# EAGLE design Crazebird-v0.5 (EAGLE 6.6.0)
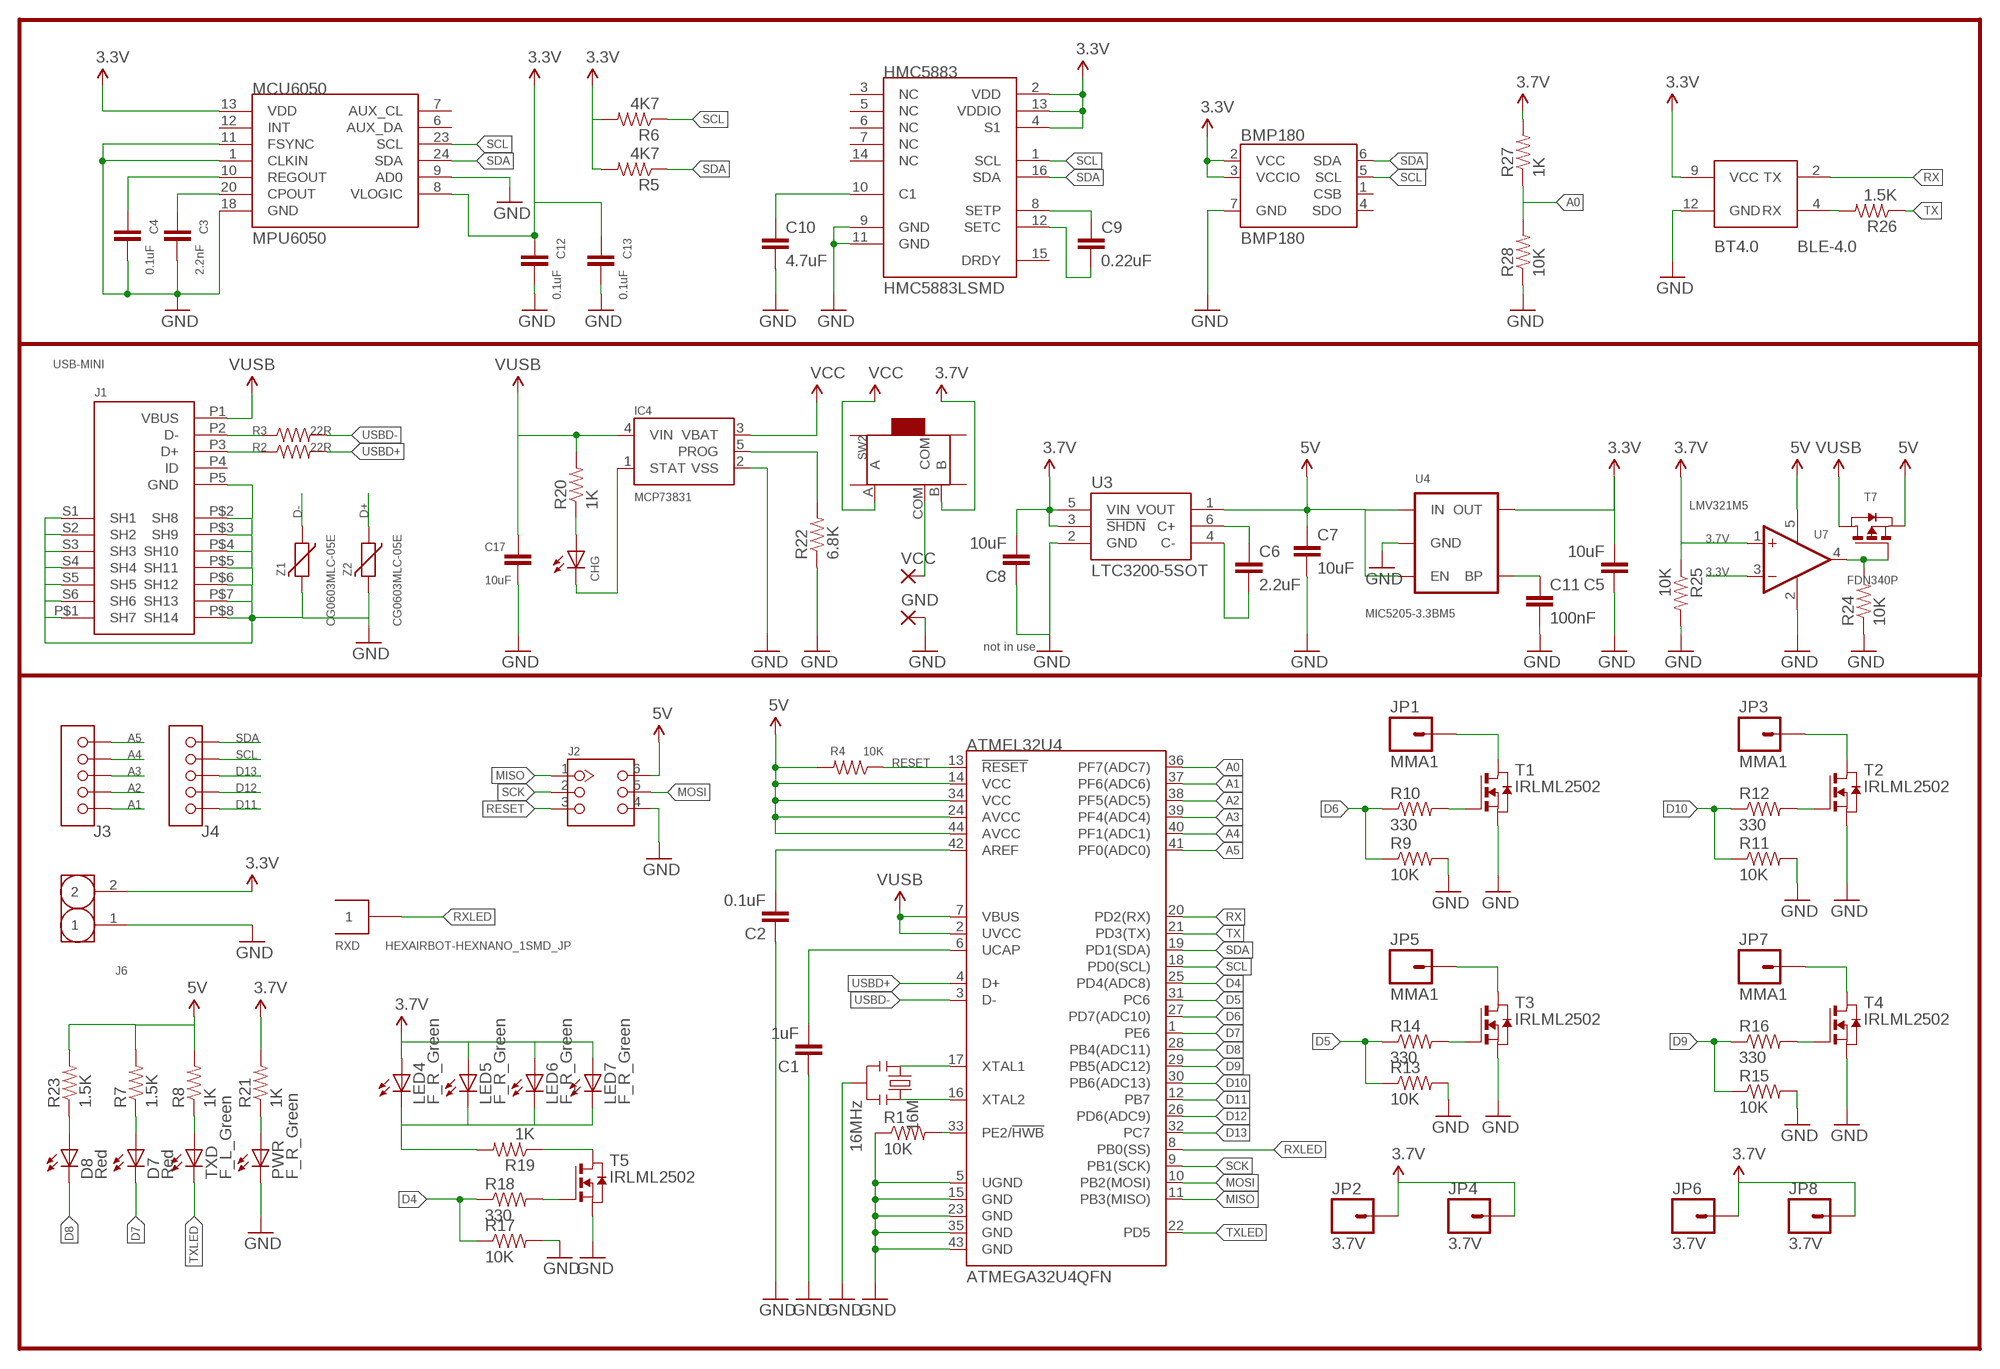
[diagram p0: schematic, sheet 1]

## Parts
16M  16MHz  RESONATOR16MHZ  [RESONATOR-SMD]
ATMEL32U4  ATMEGA32U4QFN  [SPARKFUN-DIGITALIC_QFN-44]
BMP180  BMP180  [BMP180]
BT4.0  BLE-4.0  HEXAIRBOT-HEXNANO_BLUETOOTH_HM11  [HEXAIRBOT-HEXNANO_BLUETOOTH_HM11]
C1  1uF  CAP0402-CAP  [0402-CAP]
C2  0.1uF  CAP0402-CAP  [0402-CAP]
C3  2.2nF  CAP0402-CAP  [0402-CAP]
C4  0.1uF  CAP0402-CAP  [0402-CAP]
C5  10uF  CAP0402-CAP  [0402-CAP]
C6  2.2uF  CAP0603-CAP  [0603-CAP]
C7  10uF  CAP0603-CAP  [0603-CAP]
C8  10uF  CAP0805  [0805]
C9  0.22uF  CAP0402-CAP  [0402-CAP]
C10  4.7uF  CAP0402-CAP  [0402-CAP]
C11  100nF  CAP0603-CAP  [0603-CAP]
C12  0.1uF  CAP0402-CAP  [0402-CAP]
C13  0.1uF  CAP0402-CAP  [0402-CAP]
C17  10uF  CAP0805  [0805]
CHG  Yellow  LEDCHIPLED_0603  [CHIPLED_0603]
D7  Red  LEDCHIPLED_0603  [CHIPLED_0603]
D8  Red  LEDCHIPLED_0603  [CHIPLED_0603]
GND  2,15/1,0  [2,15/1,0]
HMC5883  HMC5883LSMD  [16LPCC]
IC4  MCP73831  [SOT23-5]
J1  USB-MINI  [USB_MICRO]
J2  HEADER-2X3P-2.0  [2X3P-2.0]
J3  HEADER-5P-2.0  [5P-2.0]
J4  HEADER-5P-2.0  [5P-2.0]
J6  HEADER-2P-2.0  [2P-2.0]
JP1  MMA1  M01SMD-4.5X1.5  [PAD-1.5X4.5]
JP2  3.7V  M01SMD-4.5X1.5  [PAD-1.5X4.5]
JP3  MMA1  M01SMD-4.5X1.5  [PAD-1.5X4.5]
JP4  3.7V  M01SMD-4.5X1.5  [PAD-1.5X4.5]
JP5  MMA1  M01SMD-4.5X1.5  [PAD-1.5X4.5]
JP6  3.7V  M01SMD-4.5X1.5  [PAD-1.5X4.5]
JP7  MMA1  M01SMD-4.5X1.5  [PAD-1.5X4.5]
JP8  3.7V  M01SMD-4.5X1.5  [PAD-1.5X4.5]
LED4  F_R_Green  LEDCHIPLED_0603  [CHIPLED_0603]
LED5  F_R_Green  LEDCHIPLED_0603  [CHIPLED_0603]
LED6  F_R_Green  LEDCHIPLED_0603  [CHIPLED_0603]
LED7  F_R_Green  LEDCHIPLED_0603  [CHIPLED_0603]
MCU6050  MPU6050  TESTING_MPU-6050-1  [TESTING_QFN-24-4MM2]
PWR  F_R_Green  LEDCHIPLED_0603  [CHIPLED_0603]
R1  10K  RESISTOR0402-RES  [0402-RES]
R2  22R  RESISTOR0402-RES  [0402-RES]
R3  22R  RESISTOR0402-RES  [0402-RES]
R4  10K  RESISTOR0402-RES  [0402-RES]
R5  4K7  RESISTOR0402-RES  [0402-RES]
R6  4K7  RESISTOR0402-RES  [0402-RES]
R7  1.5K  RESISTOR0402-RES  [0402-RES]
R8  1K  RESISTOR0402-RES  [0402-RES]
R9  10K  RESISTOR0402-RES  [0402-RES]
R10  330  RESISTOR0402-RES  [0402-RES]
R11  10K  RESISTOR0402-RES  [0402-RES]
R12  330  RESISTOR0402-RES  [0402-RES]
R13  10K  RESISTOR0402-RES  [0402-RES]
R14  330  RESISTOR0402-RES  [0402-RES]
R15  10K  RESISTOR0402-RES  [0402-RES]
R16  330  RESISTOR0402-RES  [0402-RES]
R17  10K  RESISTOR0402-RES  [0402-RES]
R18  330  RESISTOR0402-RES  [0402-RES]
R19  1K  RESISTOR0402-RES  [0402-RES]
R20  1K  RESISTOR0402-RES  [0402-RES]
R21  1K  RESISTOR0402-RES  [0402-RES]
R22  6.8K  RESISTOR0402-RES  [0402-RES]
R23  1.5K  RESISTOR0402-RES  [0402-RES]
R24  10K  RESISTOR0402-RES  [0402-RES]
R25  10K  RESISTOR0402-RES  [0402-RES]
R26  1.5K  RESISTOR0402-RES  [0402-RES]
R27  1K  RESISTOR0402-RES  [0402-RES]
R28  10K  RESISTOR0402-RES  [0402-RES]
RXD  HEXAIRBOT-HEXNANO_1SMD_JP  [HEXAIRBOT-HEXNANO_1SMD]
SW2  SWITCH-3P-SMD-6.6X2.8  [3P-SMD-2CH-6.6X2.8-REINFORCE]
T1  IRLML2502  NMOSSOT23  [SOT-23]
T2  IRLML2502  NMOSSOT23  [SOT-23]
T3  IRLML2502  NMOSSOT23  [SOT-23]
T4  IRLML2502  NMOSSOT23  [SOT-23]
T5  IRLML2502  NMOSSOT23  [SOT-23]
T7  FDN340P  [SOT23]
TXD  F_L_Green  LEDCHIPLED_0603  [CHIPLED_0603]
U3  LTC3200-5SOT  [SOT23-6]
U4  MIC5205-3.3BM5  MIC52053.3V  [SOT23-5]
U7  LMV321M5  [SOT23-5]
VCC  2,15/1,0  [2,15/1,0]
Z1  CG0603MLC-05E  VARISTORCN0603  [CT/CN0603]
Z2  CG0603MLC-05E  VARISTORCN0603  [CT/CN0603]

## Nets
3.3V: BMP180.2(VCC) BMP180.3(VCCIO) BT4.0.9(VCC) C5.2 C12.1 C13.1 HMC5883.2(VDD) HMC5883.4(S1) HMC5883.13(VDDIO) J6.2 MCU6050.8(VLOGIC) MCU6050.13(VDD) R5.2 R6.2 U4.5(OUT) U7.3(-IN)
3.7V: C8.2 JP2.P$1 JP4.P$1 JP6.P$1 JP8.P$1 LED4.A LED5.A LED6.A LED7.A R21.2 R25.1 R27.2 SW2.B U3.3(!SHDN) U3.5(VIN) U7.1(+IN)
5V: ATMEL32U4.14(VCC) ATMEL32U4.24(AVCC) ATMEL32U4.34(VCC) ATMEL32U4.44(AVCC) C7.1 J2.6 R4.2 R7.2 R8.2 R23.2 T7.2(S) U3.1(VOUT) U4.1(IN) U4.3(EN) U7.5(V+)
A0: ATMEL32U4.36(PF7(ADC7)) R27.1 R28.2
A1: ATMEL32U4.37(PF6(ADC6)) J3.1
A2: ATMEL32U4.38(PF5(ADC5)) J3.2
A3: ATMEL32U4.39(PF4(ADC4)) J3.3
A4: ATMEL32U4.40(PF1(ADC1)) J3.4
A5: ATMEL32U4.41(PF0(ADC0)) J3.5
D4: ATMEL32U4.25(PD4(ADC8)) R17.1 R18.1
D5: ATMEL32U4.31(PC6) R13.1 R14.1
D6: ATMEL32U4.27(PD7(ADC10)) R9.1 R10.1
D7: ATMEL32U4.1(PE6) D7.C
D8: ATMEL32U4.28(PB4(ADC11)) D8.C
D9: ATMEL32U4.29(PB5(ADC12)) R15.1 R16.1
D10: ATMEL32U4.30(PB6(ADC13)) R11.1 R12.1
D11: ATMEL32U4.12(PB7) J4.1
D12: ATMEL32U4.26(PD6(ADC9)) J4.2
D13: ATMEL32U4.32(PC7) J4.3
D+: J1.P3(D+) R2.1 Z2.1
D-: J1.P2(D-) R3.1 Z1.1
GND: 16M.2 ATMEL32U4.5(UGND) ATMEL32U4.15(GND) ATMEL32U4.23(GND) ATMEL32U4.35(GND) ATMEL32U4.43(GND) BMP180.7(GND) BT4.0.12(GND) C1.1 C2.1 C3.2 C4.2 C5.1 C7.2 C8.1 C10.2 C11.2 C12.2 C13.2 C17.1 GND.1(P) HMC5883.9(GND) HMC5883.11(GND) IC4.2(VSS) J1.P5(GND) J1.P$1(SH7) J1.P$2(SH8) J1.P$3(SH9) J1.P$4(SH10) J1.P$5(SH11) J1.P$6(SH12) J1.P$7(SH13) J1.P$8(SH14) J1.S1(SH1) J1.S2(SH2) J1.S3(SH3) J1.S4(SH4) J1.S5(SH5) J1.S6(SH6) J2.4 J6.1 MCU6050.1(CLKIN) MCU6050.9(AD0) MCU6050.11(FSYNC) MCU6050.18(GND) PWR.C R1.1 R9.2 R11.2 R13.2 R15.2 R17.2 R22.1 R24.1 R25.2 R28.1 T1.2(S) T2.2(S) T3.2(S) T4.2(S) T5.2(S) U3.2(GND) U4.2(GND) U7.2(V-) Z1.2 Z2.2
MISO: ATMEL32U4.11(PB3(MISO)) J2.1
MOSI: ATMEL32U4.10(PB2(MOSI)) J2.5
N$1: 16M.1 ATMEL32U4.17(XTAL1)
N$2: 16M.3 ATMEL32U4.16(XTAL2)
N$3: CHG.C IC4.1(STAT)
N$4: CHG.A R20.1
N$5: ATMEL32U4.6(UCAP) C1.2
N$6: ATMEL32U4.42(AREF) C2.2
N$7: R8.1 TXD.A
N$8: C4.1 MCU6050.10(REGOUT)
N$9: C3.1 MCU6050.20(CPOUT)
N$10: D7.A R7.1
N$11: ATMEL32U4.33(PE2/!HWB) R1.2
N$12: R18.2 T5.3(G)
N$13: PWR.A R21.1
N$14: R12.2 T2.3(G)
N$15: R10.2 T1.3(G)
N$16: JP1.P$1 T1.1(D)
N$17: JP3.P$1 T2.1(D)
N$18: R14.2 T3.3(G)
N$19: JP5.P$1 T3.1(D)
N$20: R16.2 T4.3(G)
N$21: JP7.P$1 T4.1(D)
N$22: R19.1 T5.1(D)
N$23: C9.1 HMC5883.8(SETP)
N$24: LED4.C LED5.C LED6.C LED7.C R19.2
N$25: C6.1 U3.6(C+)
N$26: IC4.5(PROG) R22.2
N$27: C6.2 U3.4(C-)
N$28: C9.2 HMC5883.12(SETC)
N$29: C10.1 HMC5883.10(C1)
N$30: SW2.COM VCC.1(P)
N$31: C11.1 U4.4(BP)
N$32: D8.A R23.1
N$34: R24.2 T7.3(G) U7.4(OUT)
N$35: BT4.0.4(RX) R26.2
RESET: ATMEL32U4.13(!RESET) J2.3 R4.1
RX: ATMEL32U4.20(PD2(RX)) BT4.0.2(TX)
RXLED: ATMEL32U4.8(PB0(SS)) RXD.1
SCK: ATMEL32U4.9(PB1(SCK)) J2.2
SCL: ATMEL32U4.18(PD0(SCL)) BMP180.5(SCL) HMC5883.1(SCL) J4.4 MCU6050.23(SCL) R6.1
SDA: ATMEL32U4.19(PD1(SDA)) BMP180.6(SDA) HMC5883.16(SDA) J4.5 MCU6050.24(SDA) R5.1
TX: ATMEL32U4.21(PD3(TX)) R26.1
TXLED: ATMEL32U4.22(PD5) TXD.C
USBD+: ATMEL32U4.4(D+) R2.2
USBD-: ATMEL32U4.3(D-) R3.2
VCC: IC4.3(VBAT) SW2.A
VUSB: ATMEL32U4.2(UVCC) ATMEL32U4.7(VBUS) C17.2 IC4.4(VIN) J1.P1(VBUS) R20.2 T7.1(D)
Unconnected: BMP180.1(CSB) BMP180.4(SDO) HMC5883.3(NC) HMC5883.5(NC) HMC5883.6(NC) HMC5883.7(NC) HMC5883.14(NC) HMC5883.15(DRDY) J1.P4(ID) MCU6050.6(AUX_DA) MCU6050.7(AUX_CL) MCU6050.12(INT) SW2.SS1 SW2.SS2 SW2.SS3 SW2.SS4

## Notes on the sheet
- not in use

## Library data of the parts
16M = SparkFun-FreqCtrl:RESONATOR: Resonator Small SMD resonator. Used, eg, on the Arduino Pro/ Pro Mini boards. 8MHz- XTAL-08895 16MHz- XTAL-08900; PROD_ID: XTAL-08900
ATMEL32U4 = SparkFun-DigitalIC:ATMEGA32U4: Atmel 44-pin 8-bit Microcontroller with 32KBytes of ISP Flash and USB Controller ----- Please use the QFN-44-NOPAD_1:1 package for the footprint of all boards using a 32U4. Route traces directly away from the pads as much as possible.
BMP180 = duinofun-ic:BMP180: BMP085 Pressure Sensor Great little MEMS pressure sensor. SKU: COM-09603
BT4.0 = MainBoard:HEXAIRBOT-HEXNANO_BLUETOOTH_HM11: BLE 4.0 Module
C1-C13 = SparkFun-Passives:CAP: Capacitor Standard 0603 ceramic capacitor, and 0.1" leaded capacitor.
C17 = SparkFun:CAP: Capacitor Standard 0603 ceramic capacitor, and 0.1" leaded capacitor.
CHG D7 D8 LED4-LED7 PWR TXD = led:LED: LED OSRAM: - CHIPLED LG R971, LG N971, LY N971, LG Q971, LY Q971, LO R971, LY R971 LH N974, LH R974 LS Q976, LO Q976, LY Q976 LO Q996 - Hyper CHIPLED LW Q18S LB Q993, LB Q99A, LB R99A - SideLED LS A670, LO A670, LY A670, LG A670, LP A670 LB A673, LV A673, LT A673, LW A673 LH A674 LY A675 LS A676, LA A676, LO A676, LY A676, LW A676 LS A679, LY A679, LG A679 - Hyper Micro SIDELED® LS Y876, LA Y876, LO Y876, LY Y876 LT Y87S - SmartLED LW L88C, LW L88S LB L89C, LB L89S, LG L890 LS L89K, LO L89K, LY L89K LS L896, LA L896, LO L896, LY L896 - TOPLED LS T670, LO T670, LY T670, LG T670, LP T670 LSG T670, LSP T670, LSY T670, LOP T670, LYG T670 LG T671, LOG T671, LSG T671 LB T673, LV T673, LT T673, LW T673 LH T674 LS T676, LA T676, LO T676, LY T676, LB T676, LH T676, LSB T676, LW T676 LB T67C, LV T67C, LT T67C, LS T67K, LO T67K, LY T67K, LW E67C LS E67B, LA E67B, LO E67B, LY E67B, LB E67C, LV E67C, LT E67C LW T67C LS T679, LY T679, LG T679 LS T770, LO T770, LY T770, LG T770, LP T770 LB T773, LV T773, LT T773, LW T773 LH T774 LS E675, LA E675, LY E675, LS T675 LS T776, LA T776, LO T776, LY T776, LB T776 LHGB T686 LT T68C, LB T68C - Hyper Mini TOPLED® LB M676 - Mini TOPLED Santana® LG M470 LS M47K, LO M47K, LY M47K Source: http://www.osram.convergy.de LUXEON: - LUMILED® LXK2-PW12-R00, LXK2-PW12-S00, LXK2-PW14-U00, LXK2-PW14-V00 LXK2-PM12-R00, LXK2-PM12-S00, LXK2-PM14-U00 LXK2-PE12-Q00, LXK2-PE12-R00, LXK2-PE12-S00, LXK2-PE14-T00, LXK2-PE14-U00 LXK2-PB12-K00, LXK2-PB12-L00, LXK2-PB12-M00, LXK2-PB14-N00, LXK2-PB14-P00, LXK2-PB14-Q00 LXK2-PR12-L00, LXK2-PR12-M00, LXK2-PR14-Q00, LXK2-PR14-R00 LXK2-PD12-Q00, LXK2-PD12-R00, LXK2-PD12-S00 LXK2-PH12-R00, LXK2-PH12-S00 LXK2-PL12-P00, LXK2-PL12-Q00, LXK2-PL12-R00 Source: www.luxeon.com KINGBRIGHT: KA-3528ASYC Source: www.kingbright.com
GND VCC = wirepad:2,15/1,0: THROUGH-HOLE PAD
HMC5883 = HexAirbot-HexNano:HMC5883L: 3 Axis Digital Compass IC
IC4 = SparkFun:MCP73831: Microchip's MCP73831 Miniature single cell, fully integrated Li-Ion, Li-polymer charge management controller http://ww1.microchip.com/downloads/en/DeviceDoc/21984a.pdf
J1 = QXZ:USB-MINI
J2 = SeeedStudio-Connector:HEADER-2X3P
J3 J4 = SeeedStudio-Connector:HEADER-5P
J6 = SeeedStudio-Connector:HEADER-2P
JP1-JP8 = SparkFun-Connectors:M01: Header 1 Standard 1-pin 0.1" header. Use with straight break away headers (SKU : PRT-00116), right angle break away headers (PRT-00553), swiss pins (PRT-00743), machine pins (PRT-00117), and female headers (PRT-00115).
MCU6050 = MPU6050:TESTING_MPU-6050
R1-R28 = SparkFun-Passives:RESISTOR: Resistor Basic schematic elements and footprints for 0603, 1206, and PTH resistors.
RXD = MainBoard:HEXAIRBOT-HEXNANO_1SMD_JP
SW2 = duinofun-ic:SWITCH-3P-SMD
T1-T5 = zetex:NMOSSOT23: MOS FET; OC_FARNELL: unknown; OC_NEWARK: unknown
T7 = HexAirbot-HexNano:FDN340P: MOS FET
U3 = HexAirbot-HexNano:LTC3200-5: Linear Technology. Low Noise, Regulated Charge Pump DC/DC Converters, SOT23-6. Fixed 5V ± 4% Output or ADJ VIN Range: 2.7V to 4.5V
U4 = SparkFun-PowerIC:MIC5205: MIC5205 150mA vreg 3.3V - VREG-00822 5V - VREG-00823; PROD_ID: VREG-00822
U7 = linear:LMV321?*: General Purpose, Low Voltage, Rail-to-Rail Output Operational Amplifiers Source: http://www.national.com/mpf/LM/LMV321.html http://www.national.com/dt/lmv_qual.pdf
Z1 Z2 = varistor:VARISTOR: VARISTOR

## Net classes
0 default: width 0.254 mm, drill 0.61 mm, clearance 0.254 mm
2 gnd: width 0.254 mm, drill 0.61 mm, clearance 0.254 mm

## Board
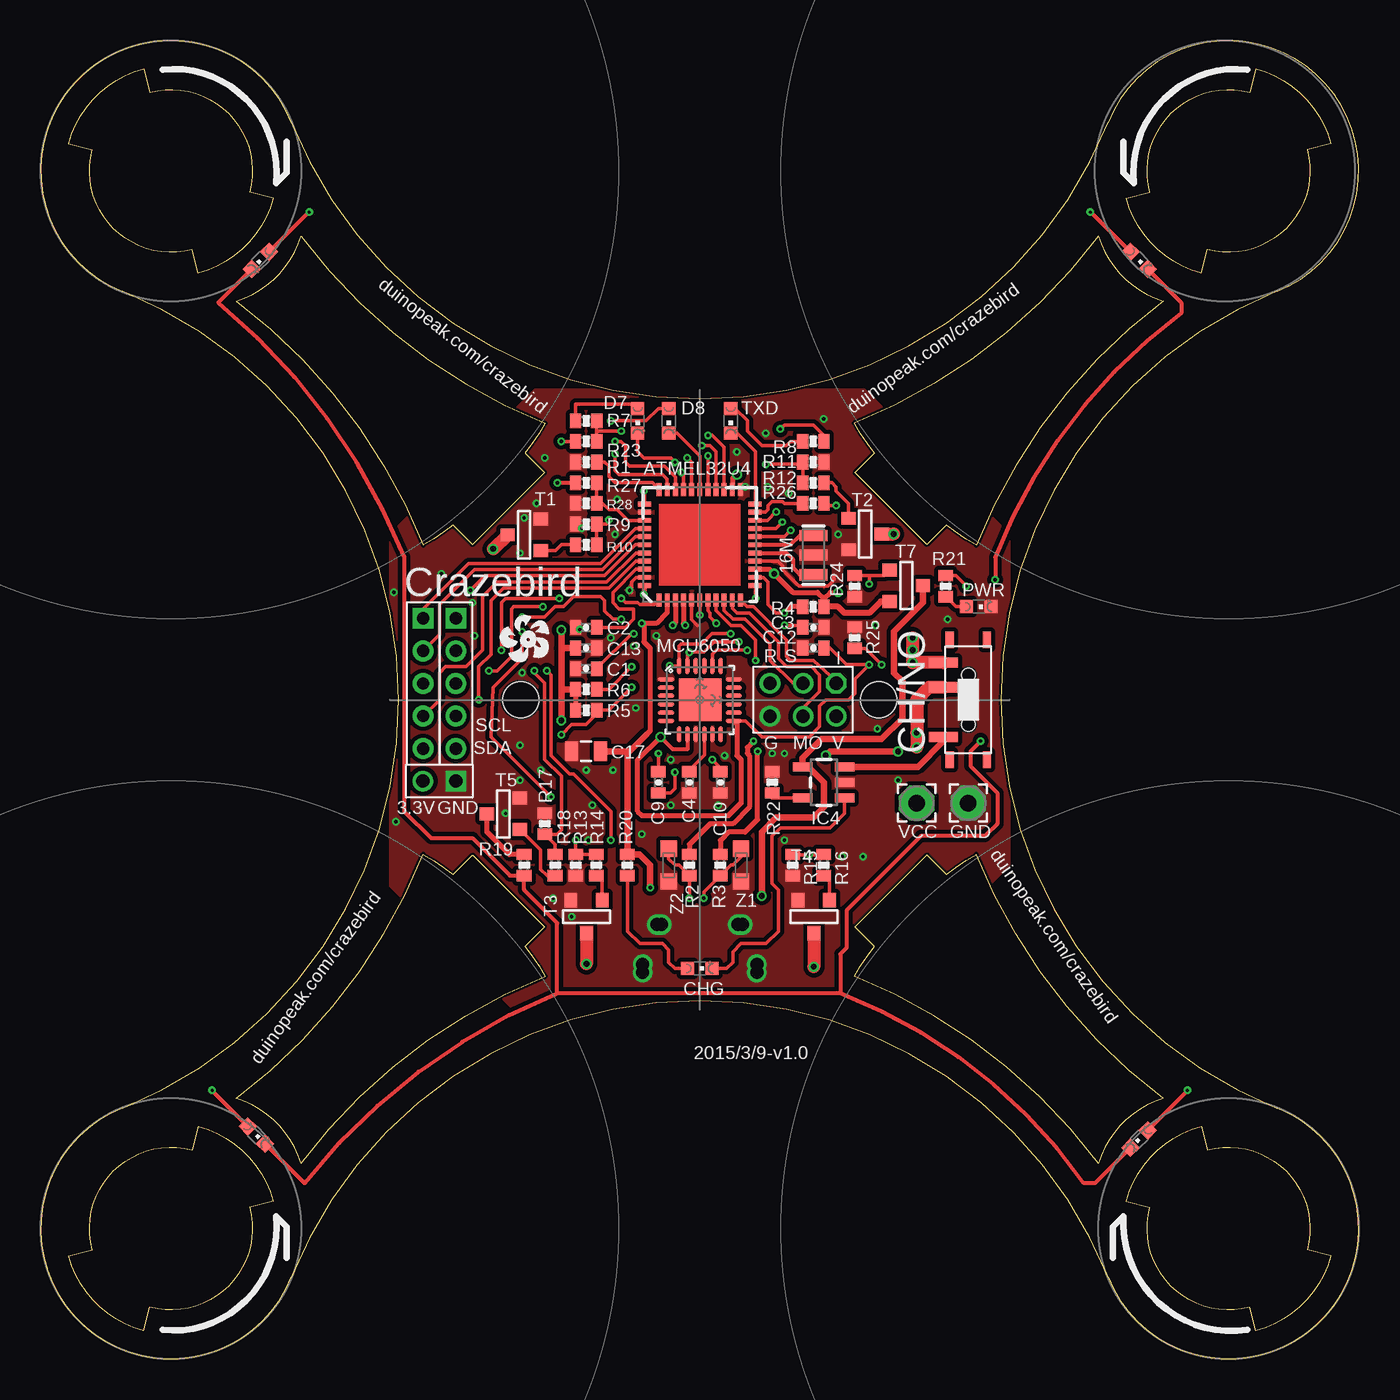
[diagram p1: board, top side]
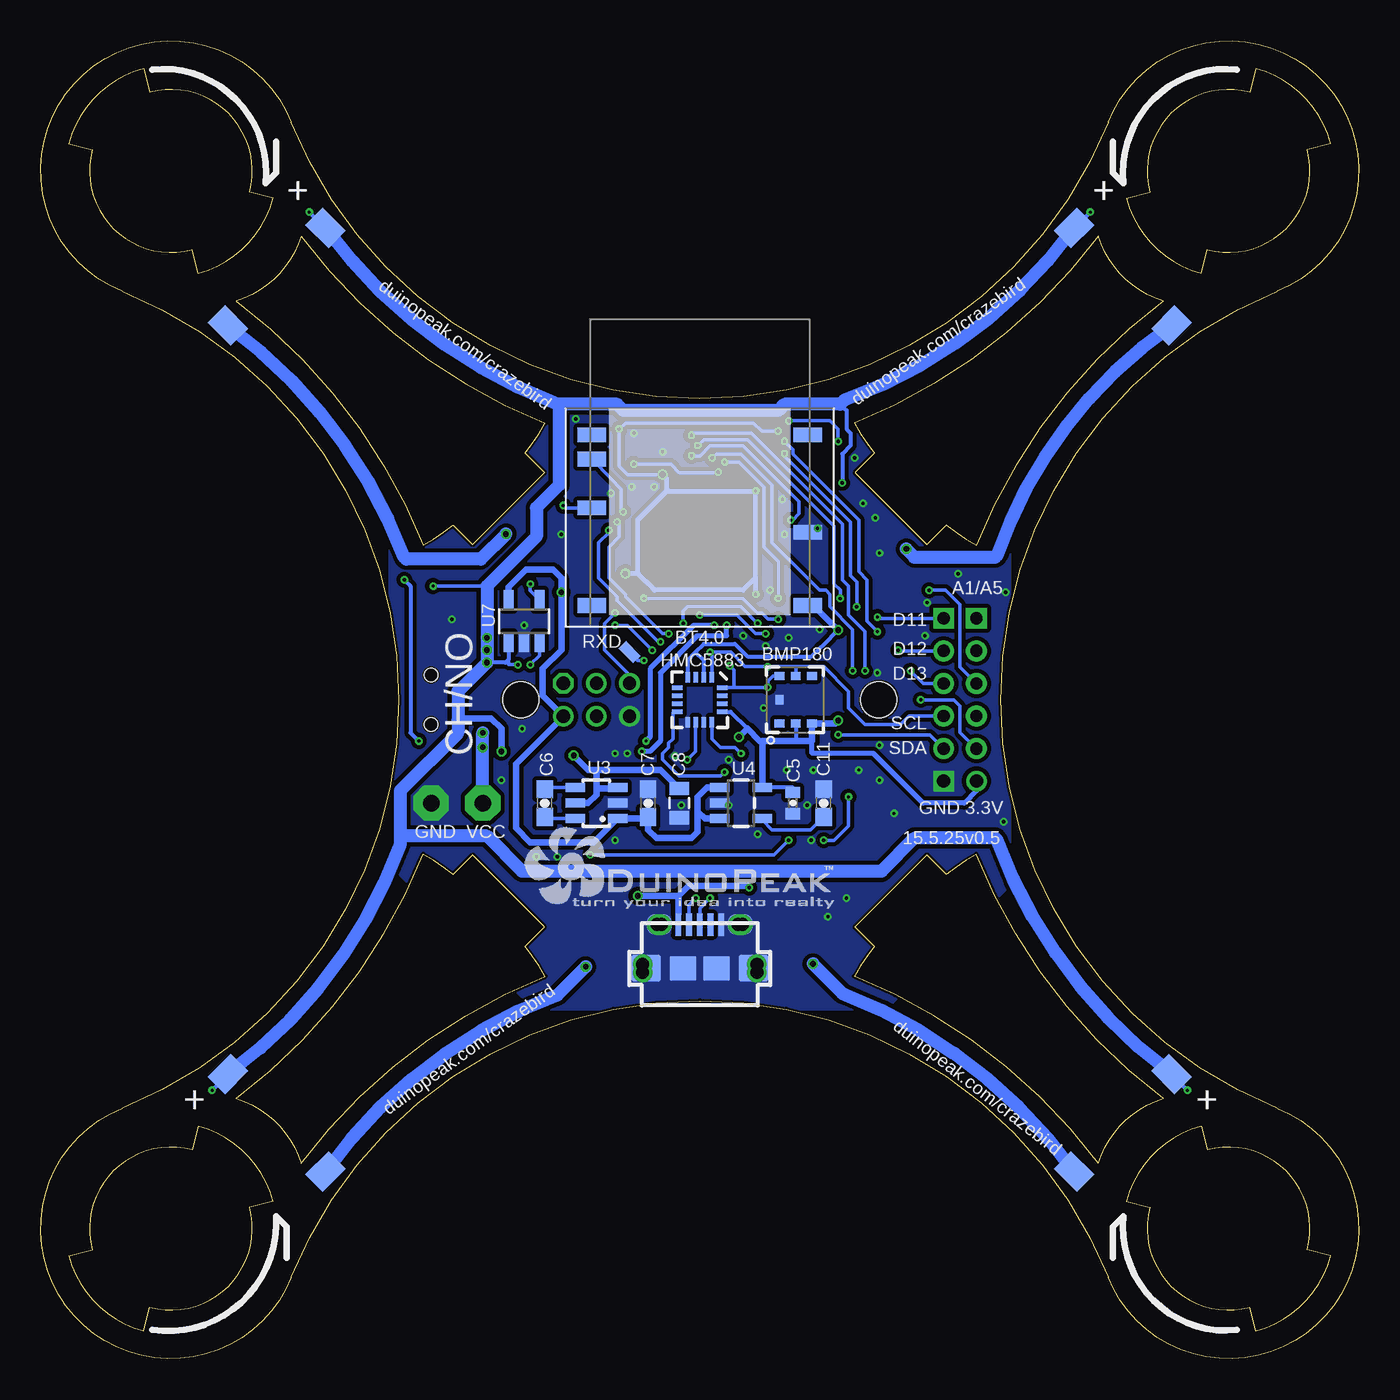
[diagram p2: board, bottom side, seen from below]

Size 81.01 x 81.01 mm. Coordinates in mm from the lower left corner, seen from the top.
Copper layers (1*16): Top 0.035mm / dielectric 1.5mm / Bottom 0.035mm
Design rules "Sparkfun *": minimum track width 5mil, minimum drill 8mil, track to track 5mil, track to pad 5mil, pad to pad 8mil, via to via 8mil, smd to smd 5mil, copper to edge 5mil, drill to drill 8mil, minimum pad ring 7mil, minimum via ring 5mil, stop-mask expansion 4mil, vias tented up to drill 25mil, thermal gap 5mil

### Footprints (pad centres in the part's own frame; a part is rotated, then mirrored left to right if it is on the bottom)
RESONATOR-SMD = smd 0.7 x 1.7: 1 -1.2,0; 2 0,0; 3 1.2,0
SPARKFUN-DIGITALIC_QFN-44 = smd 0.8 x 0.3: 1 -3.4,2.5; 2 -3.4,2; 3 -3.4,1.5; 4 -3.4,1; 5 -3.4,0.5; 6 -3.4,0; 7 -3.4,-0.5; 8 -3.4,-1; 9 -3.4,-1.5; 10 -3.4,-2; 11 -3.4,-2.5; 23 3.4,-2.5; 24 3.4,-2; 25 3.4,-1.5; 26 3.4,-1; 27 3.4,-0.5; 28 3.4,0; 29 3.4,0.5; 30 3.4,1; 31 3.4,1.5; 32 3.4,2; 33 3.4,2.5 | smd 0.3 x 0.8: 12 -2.5,-3.4; 13 -2,-3.4; 14 -1.5,-3.4; 15 -1,-3.4; 16 -0.5,-3.4; 17 0,-3.4; 18 0.5,-3.4; 19 1,-3.4; 20 1.5,-3.4; 21 2,-3.4; 22 2.5,-3.4; 34 2.5,3.4; 35 2,3.4; 36 1.5,3.4; 37 1,3.4; 38 0.5,3.4; 39 0,3.4; 40 -0.5,3.4; 41 -1,3.4; 42 -1.5,3.4; 43 -2,3.4; 44 -2.5,3.4
BMP180 = smd 0.5 x 0.6: 1 -1.45,1.45; 2 -1.45,0.45; 3 -1.45,-0.55; 4 1.45,-0.55; 5 1.45,0.45; 6 1.45,1.45 | smd 0.6 x 0.5: 7 0,1.45
HEXAIRBOT-HEXNANO_BLUETOOTH_HM11 = smd 1.75 x 0.9: 1 -6.625,4.859; 2 -6.625,3.359; 4 -6.625,0.359; 8 -6.625,-5.641; 9 6.625,-5.641; 12 6.625,-1.141; 16 6.625,4.859
0402-CAP = smd 0.7 x 0.9: 1 -0.65,0; 2 0.65,0
0603-CAP = smd 1.1 x 1: 1 -0.85,0; 2 0.85,0
0805 = smd 0.8 x 1.2: 1 -0.9,0; 2 0.9,0
CHIPLED_0603 = smd 0.8 x 0.8: A 0,-0.75; C 0,0.75
2,15/1,0 = drill 1.016 pad 2.159 octagon: 1 0,0
16LPCC = smd 0.65 x 0.28: 1 -1.37,0.75; 2 -1.37,0.25; 3 -1.37,-0.25; 4 -1.37,-0.75; 9 1.37,-0.75; 10 1.37,-0.25; 11 1.37,0.25; 12 1.37,0.75 | smd 0.28 x 0.65: 5 -0.75,-1.37; 6 -0.25,-1.37; 7 0.25,-1.37; 8 0.75,-1.37; 13 0.75,1.37; 14 0.25,1.37; 15 -0.25,1.37; 16 -0.75,1.37
SOT23-5 = smd 0.55 x 1.2: 1 -0.95,-1.3; 2 0,-1.3; 3 0.95,-1.3; 4 0.95,1.3; 5 -0.95,1.3
USB_MICRO = smd 0.406 x 1.346: P1 -1.321,2.692; P2 -0.66,2.692; P3 0,2.692; P4 0.66,2.692; P5 1.321,2.692 | drill 0.8 pad 1.27: P$1 -2.616,2.692 | drill 0.8 pad 1.245: P$2 -2.362,2.692; P$7 2.362,2.692; P$8 2.616,2.692 | drill 0.8 pad 1.143: P$3 -3.505,-0.254; P$4 -3.505,0.254; P$5 3.505,0.254; P$6 3.505,-0.254 | smd 1.778 x 1.651: S1 -3.302,0; S2 3.302,0 | smd 1.524 x 1.27: S3 -2.489,2.692; S4 2.489,2.692 | smd 1.626 x 1.524: S5 -1.016,0; S6 1.016,0
2X3P-2.0 = drill 0.813 pad 1.27 octagon: 1 -1.016,2.032 | drill 0.813 pad 1.27: 2 -1.016,0; 3 -1.016,-2.032; 4 1.016,-2.032; 5 1.016,0; 6 1.016,2.032
5P-2.0 = drill 0.762 pad 1.27 square: 1 0,4 | drill 0.762 pad 1.27: 2 0,2; 3 0,0; 4 0,-2; 5 0,-4
2P-2.0 = drill 0.813 pad 1.27 square: 1 -1.016,0 | drill 0.813 pad 1.27: 2 1.016,0
PAD-1.5X4.5 = smd 1.5 x 2: P$1 0,0
TESTING_QFN-24-4MM2 = smd 1.016 x 0.254: 1 -2.066,1.257; 2 -2.066,0.75; 3 -2.066,0.247; 4 -2.066,-0.287; 5 -2.066,-0.792; 6 -2.066,-1.297; 13 2.086,-1.297; 14 2.086,-0.792; 15 2.086,-0.287; 16 2.086,0.247; 17 2.086,0.75; 18 2.086,1.257 | smd 0.254 x 1.016: 7 -1.267,-2.122; 8 -0.762,-2.122; 9 -0.258,-2.122; 10 0.278,-2.122; 11 0.78,-2.122; 12 1.287,-2.122; 19 1.287,2.082; 20 0.78,2.082; 21 0.278,2.082; 22 -0.258,2.082; 23 -0.762,2.082; 24 -1.267,2.082 | smd 2.616 x 2.616: P$1 0.02,-0.01
0402-RES = smd 0.7 x 0.9: 1 -0.65,0; 2 0.65,0
HEXAIRBOT-HEXNANO_1SMD = smd 1.27 x 0.635: 1 0,0
3P-SMD-2CH-6.6X2.8-REINFORCE = smd 1.778 x 0.635: A 1.524,2.286; B 1.524,-2.286; COM 1.524,-0.762 | smd 0.508 x 1.016: SS1 -1.143,-3.683; SS2 1.143,-3.683; SS3 1.143,3.683; SS4 -1.143,3.683 | hole 0.813: 0,-1.524; 0,1.524
SOT-23 = smd 0.787 x 0.889: 1 0.025,-1.016; 2 -0.94,1.016; 3 0.991,1.016
SOT23 = smd 0.787 x 0.889: 1 0.025,-1.016; 2 -0.94,1.016; 3 0.991,1.016
SOT23-6 = smd 0.55 x 1.2: 1 -0.95,-1.3; 2 0,-1.3; 3 0.95,-1.3; 4 0.95,1.3; 5 0,1.3; 6 -0.95,1.3
SOT23-5' = smd 0.6 x 1.2: 1 -0.95,-1.306; 2 0,-1.306; 3 0.95,-1.306; 4 0.95,1.306; 5 -0.95,1.306
XFK-MINI-X4B = hole 2.2: -11,0; 11,0
CT/CN0603 = smd 1 x 1: 1 -1,0; 2 1,0

### Placement (x,y rotation side)
16M  47.49,49.4 270 top
ATMEL32U4  40.51,50.03 90 top
BMP180  34.16,40.51 90 bottom
BT4.0  40.51,51.94 0 bottom
C1  33.52,42.41 0 top
C2  33.52,44.95 0 top
C3  47.49,44.95 0 top
C4  39.87,35.43 270 top
C5  34.79,34.16 90 bottom
C6  50.03,34.16 90 bottom
C7  43.68,34.16 90 bottom
C8  41.78,34.16 90 bottom
C9  37.97,35.43 90 top
C10  41.78,35.43 270 top
C11  32.89,34.16 90 bottom
C12  47.49,43.68 180 top
C13  33.52,43.68 0 top
C17  33.52,37.33 0 top
CHG  40.51,24 270 top
D7  36.7,57.65 180 top
D8  38.6,57.65 180 top
GND  57.02,34.16 0 top
HMC5883  40.51,40.51 270 bottom
IC4  48.13,35.43 90 top
J1  40.51,24 0 bottom
J2  46.86,40.51 270 top
J3  23.51,41.51 0 top
J4  25.51,41.51 0 top
J6  24.51,35.51 180 top
JP1  11.51,63.51 135 bottom
JP2  17.51,69.51 135 bottom
JP3  69.51,63.51 45 bottom
JP4  69.51,17.51 315 bottom
JP5  17.51,11.51 45 bottom
JP6  63.51,69.51 45 bottom
JP7  63.51,11.51 315 bottom
JP8  11.51,17.51 45 bottom
LED4  13.51,67.51 135 top
LED5  67.51,67.51 225 top
LED6  67.51,13.51 135 top
LED7  13.26,13.75 225 top
MCU6050  40.51,40.51 0 top
PWR  57.65,46.22 270 top
R1  33.52,55.11 0 top
R2  39.87,30.35 90 top
R3  41.78,30.35 90 top
R4  47.49,46.22 0 top
R5  33.52,39.87 180 top
R6  33.52,41.14 180 top
R7  33.52,57.65 0 top
R8  47.49,56.38 0 top
R9  33.52,51.3 180 top
R10  33.52,50.03 180 top
R11  47.49,55.11 0 top
R12  47.49,53.84 0 top
R13  32.89,30.35 270 top
R14  34.16,30.35 270 top
R15  46.22,30.35 270 top
R16  48.13,30.35 270 top
R17  30.98,32.89 90 top
R18  31.62,30.35 270 top
R19  29.71,30.35 270 top
R20  36.06,30.35 90 top
R21  55.62,47.49 90 top
R22  44.95,35.43 270 top
R23  33.52,56.38 0 top
R24  50.03,47.49 90 top
R25  50.03,44.32 90 top
R26  47.49,52.57 0 top
R27  33.52,53.84 180 top
R28  33.52,52.57 0 top
RXD  44.82,43.43 315 bottom
SW2  57.02,40.51 180 top
T1  29.71,50.67 270 top
T2  50.67,50.67 90 top
T3  33.52,27.17 0 top
T4  47.49,27.17 0 top
T5  28.44,33.52 270 top
T7  53.21,47.49 90 top
TXD  42.41,57.65 180 top
U3  46.86,34.16 90 bottom
U4  37.97,34.16 270 bottom
U7  LMV321M5  [SOT23-5']  51.3,45.33 0 bottom
U$2  [DUINOFUN-LOGO-0.65]  51.3,27.68 0 bottom
U$3  [DUINOFUN-LOGO-PCB-0.4]  28.19,42.79 0 top
U$5  [XFK-MINI-X4B]  40.51,40.51 0 top
VCC  53.84,34.16 0 top
Z1  43.05,30.35 270 top
Z2  38.6,30.35 270 top

### Tracks (layer width: path | path; a pad name or v marks a point on that pad's centre or on a via)
3.3V  (via drill 0.2, 0.36)
  Top 0.203: 32.89,41.14 32,41.14 | MCU6050.13 43.33,39.21 44.32,38.22 47.24,38.22 47.87,38.86 47.87,40.13 48.25,40.51 49.65,40.51 50.03,40.89 50.03,41.78 v50.92,42.67 49.52,42.67 48.51,43.68 C12.1
  Top 0.254: MCU6050.8 39.74,37.46 38.86,37.46 v38.09,38.22
  Top 0.305: R5.2 R6.2 32.89,41.14 | 32.89,41.14 | 32.89,41.14 | v38.09,38.22 36.7,36.82 36.7,33.65 36.95,33.39 42.28,33.39 43.05,34.16 43.05,36.82 42.79,37.08 42.79,39.01 MCU6050.13
  Top 0.406: C13.1 32,43.68 | 32,43.68 32,41.14 | 32,41.14 R6.2 | v32,44.79 32,43.68 | 32,41.14 v32,39.24
  Bottom 0.203: BT4.0.9 33.51,46.3 | U7.3 50.35,43.23 v50.92,42.67
  Bottom 0.254: HMC5883.2 40.26,42.92 40.76,43.42 40.76,43.43 | HMC5883.4 41.26,42.93 40.76,43.43 | HMC5883.13 38.61,39.76 37.59,38.73 | 36.82,37.97 36.67,37.97 | BMP180.2 34.61,37.97 | C5.2 34.79,35.11 U4.5 | v32,44.79 32.87,43.91 33.13,43.68 33.63,43.17 37.59,43.17 38.35,43.94 40.25,43.94 40.76,43.43
  Bottom 0.305: J6.2 23.49,34.92 24.25,34.16 26.79,34.16 29.84,37.2 33.61,37.2 33.61,37.97
  Bottom 0.406: 36.82,37.97 37.59,38.73 v38.09,38.22 | U4.5 36.67,37.97 34.61,37.97 33.61,37.97 BMP180.3 32.18,39.06 v32,39.24 | 33.51,46.3 v32,44.79
3.7V  (via drill 0.2, 0.36)
  Top 0.203: v56.89,47.49 56.24,48.14 R21.2 | R25.1 50.68,43.67 v51.68,42.67
  Top 0.254: LED7.A 10.53,16.48 v10.53,16.5 | LED4.A 16.48,70.48 v16.5,70.48 | LED6.A 70.48,16.48 v70.48,16.5 | LED5.A 64.53,70.48 v64.51,70.48 | v31.74,53.84 R27.2
  Top 0.406: v52.7,37.33 48.51,37.33 v48.25,37.08
  Top 0.813: SW2.B v53.59,42.79 v53.59,43.55 v53.59,44.32
  Bottom 0.203: 53.59,47.49 v56.89,47.49 | 52.25,42.99 52.25,42.67 v51.68,42.67
  Bottom 0.254: v10.53,16.5 11.51,17.48 JP8.P$1 | v16.5,70.48 17.48,69.51 JP2.P$1 | v70.48,16.5 69.51,17.48 JP4.P$1 | v64.51,70.48 63.54,69.51 JP6.P$1 | U7.1 52.25,42.99 52.44,42.79 v53.59,42.79 | 31.87,58.67 31.49,58.29 31.49,57.14 31.24,56.89 31.24,56.13 31.74,55.62 v31.74,53.84
  Bottom 0.406: U3.5 47.36,34.16 46.86,34.66 46.86,35.05 | C8.2 42.91,36.19 46.86,36.19 | 53.52,42.79 v53.59,42.79 | v52.7,37.33 52.7,38.73 53.33,39.36 55.24,39.36 55.37,39.24 | 46.86,36.19 47.36,36.19 v48.25,37.08 | 46.86,35.05 46.86,36.19 | U3.3 45.62,35.05 46.86,35.05
  Bottom 0.813: 58.92,32.12 58.92,34.92 55.37,38.47 55.37,39.24 55.37,41.01 v53.59,42.79 53.59,47.49 50.54,50.54 50.54,52.32 49.14,53.71 49.14,58.54 49.27,58.67 | 58.92,32.12 58.92,31.62 arc34 JP4.P$1 | JP2.P$1 arc34 31.62,58.92 31.87,58.67 35.3,58.67 35.68,58.29 45.21,58.29 45.59,58.67 49.27,58.67 | 49.27,58.67 arc33 JP6.P$1 | JP8.P$1 arc33 22.22,31.87 22.35,32 27.3,32 29.33,29.97 51.43,29.97 53.59,32.12 58.92,32.12
5V  (via drill 0.2, 0.36)
  Top 0.203: 34.17,57.02 R23.2 | ATMEL32U4.34 37.11,53.3 v37.08,53.33 | R7.2 34.17,57.02 | 34.17,57.02 v35.68,57.02 | v45.46,57.14 45.71,57.4 47.49,57.4 48.14,56.75 R8.2
  Top 0.305: ATMEL32U4.24 42.54,53.84 42.54,54.13 42.76,54.35 v42.79,54.35 | ATMEL32U4.14 44.8,48.53 45.08,48.38 v45.08,48.25 46.22,47.11 47.75,47.11 48.14,46.71 | 48.14,46.71 R4.2 | 48.14,46.71 48.54,47.11 v49.02,47.11 | ATMEL32U4.44 37.08,47.53 v37.08,46.98
  Top 0.356: T7.2 51.63,46.55 50.92,45.84 49.4,45.84 49.02,46.22 R4.2
  Top 0.406: 48.14,46.49 R4.2
  Bottom 0.203: v35.68,57.02 36.7,57.02 37.2,57.52 45.08,57.52 v45.46,57.14 45.46,54.86 44.95,54.35 v42.79,54.35
  Bottom 0.305: v42.79,54.35 42.54,54.1 42.54,53.33 | 42.54,53.33 v37.08,53.33 37.08,48 | 42.54,53.33 44.32,51.56 44.32,48.25 | 37.08,48 v37.08,46.98 | 37.08,48 37.84,47.24 43.3,47.24 44.32,48.25 | 44.32,48.25 v45.08,48.25
  Bottom 0.406: U4.1 40.06,35.11 40.63,34.54 40.63,33.65 | U4.3 40.19,33.21 40.63,33.65 | U7.5 52.25,47.43 51.17,48.51 49.52,48.51 49.02,48 v49.02,47.11 49.02,43.55 50.16,42.41 50.16,40.76 J2.6 51.81,36.57 51.81,32.63 50.92,31.74 47.02,31.74 U3.1 43.78,33.21 C7.1 43.68,32.51 43.17,32 41.01,32 40.63,32.38 40.63,33.65
A0
  Top 0.203: R27.1 R28.2 34.54,52.57 34.92,52.19 35.43,52.19 36.09,51.53 ATMEL32U4.36
A1
  Top 0.203: J3.1 23.51,46.09 26.3,48.89 34.41,48.89 36.55,51.03 ATMEL32U4.37
A2
  Top 0.203: ATMEL32U4.38 36.56,50.53 34.54,48.51 26.66,48.51 24.5,46.35 24.5,44.5 J3.2
A3  (via drill 0.2)
  Top 0.203: ATMEL32U4.39 36.57,50.03 34.66,48.13 27.3,48.13 v26.41,47.24
  Bottom 0.203: J3.3 24.5,42.5 24.5,46.35 25.39,47.24 v26.41,47.24
A4
  Top 0.203: ATMEL32U4.40 36.58,49.53 34.79,47.75 28.06,47.75 27.17,46.86 27.17,43.55 26.16,42.54 24.89,42.54 24.5,42.16 24.5,40.5 J3.4
A5  (via drill 0.2)
  Top 0.203: ATMEL32U4.41 36.59,49.03 34.92,47.36 28.44,47.36 27.68,46.6 27.68,43.3 26.92,42.54 v26.92,40.51
  Bottom 0.203: v26.92,40.51 24.89,40.51 24.5,40.13 24.5,38.5 J3.5
D4  (via drill 0.2)
  Top 0.203: R18.1 31.62,31.6 R17.1 31.73,32.24 32,32.51 32,35.81 30.98,36.82 30.98,41.52 30.35,42.16 v30.35,42.28 | ATMEL32U4.25 42.01,56.02 41.27,56.76 v41.01,56.76
  Bottom 0.203: v30.35,42.28 30.35,44.7 31.36,45.71 31.36,47.49 31.74,47.87 31.74,51.3 37.33,56.89 40.89,56.89 v41.01,56.76
D5  (via drill 0.2)
  Top 0.203: ATMEL32U4.31 39.01,54.2 38.35,54.86 36.19,54.86 35.93,55.11 35.93,56.13 35.68,56.38 v35.3,56.38 | v32.89,31.87 R13.1 R14.1 | v31.36,34.54 27.68,38.22 27.81,41.27 29.58,43.05 v29.58,44.7
  Bottom 0.203: v35.3,56.38 34.79,55.87 34.79,55.62 30.73,51.56 30.73,48.38 30.22,47.87 30.22,45.33 v29.58,44.7 | v31.36,34.54 31.36,32.76 32.25,31.87 v32.89,31.87
D6  (via drill 0.2)
  Top 0.203: R10.1 R9.1 34.79,51.3 34.92,51.43 v34.92,51.56 | ATMEL32U4.27 41.01,55.48 v41.01,55.49
  Bottom 0.203: v41.01,55.49 40.51,55.49 39.87,56.13 37.84,56.13 34.41,52.7 34.41,51.94 34.79,51.56 v34.92,51.56
D7  (via drill 0.2)
  Top 0.203: D7.C 36.7,55.75 37.08,55.37 38.73,55.37 v38.98,55.11 | v35.68,46.73 35.93,46.48 36.7,46.48 36.82,46.35 37.72,46.35 ATMEL32U4.1 38.01,46.48
  Bottom 0.203: v38.98,55.11 38.09,55.11 36.57,53.59 36.57,49.9 35.68,49.02 v35.68,46.73
D8
  Top 0.203: ATMEL32U4.28 40.51,55.49 39.1,56.9 D8.C
D9  (via drill 0.2)
  Top 0.203: ATMEL32U4.29 40.01,55.1 v39.74,55.37 | v35.05,31.87 35.05,33.65 32.76,35.93 32.51,35.93 31.36,37.08 31.36,42.03 v31.11,42.28 | R16.1 48.11,30.98 v47.24,30.98 46.24,30.98 R15.1
  Bottom 0.203: v39.74,55.37 39.49,55.62 37.97,55.62 36.06,53.71 36.06,50.16 33.14,47.24 32.76,47.24 32.51,46.98 32.51,46.22 31.11,44.82 v31.11,42.28 | v35.05,31.87 35.93,30.98 v47.24,30.98
D10  (via drill 0.2)
  Top 0.203: R12.1 R11.1 46.71,54.98 v44.57,54.98 | ATMEL32U4.30 39.51,54.33 v39.36,54.48
  Bottom 0.203: v44.57,54.98 42.28,54.98 41.78,54.48 v39.36,54.48
D11  (via drill 0.2)
  Top 0.203: ATMEL32U4.12 43.94,47.5 v43.94,46.73 | v35.68,45.46 35.17,45.46 34.66,45.97 34.66,46.6 34.41,46.86 32.76,46.86 32.12,46.22 31.62,46.22 30.98,45.59 v29.58,45.59
  Bottom 0.203: J4.1 29.5,45.51 v29.58,45.59 | v35.68,45.46 36.32,45.46 36.7,45.84 36.95,45.84 37.84,46.73 v43.94,46.73
D12  (via drill 0.2)
  Top 0.203: ATMEL32U4.26 41.51,55.76 41.14,56.13 v40.63,56.13 | v31.87,46.73 28.57,46.73 28.31,46.48 v28.31,43.55
  Bottom 0.203: J4.2 28.27,43.51 v28.31,43.55 | v31.87,46.73 31.87,47.24 32.25,47.62 32.25,51.17 37.59,56.51 40.25,56.51 v40.63,56.13
D13  (via drill 0.2)
  Top 0.203: ATMEL32U4.32 38.51,54.06 38.22,54.35 35.55,54.35 35.3,54.6 v35.3,55.62 | v30.85,46.22 29.08,46.22 28.95,46.09 28.95,43.17 28.06,42.28 v27.55,42.28
  Bottom 0.203: J4.3 26.77,41.51 v27.55,42.28 | v35.3,55.62 35.3,55.49 31.24,51.43 31.24,48.13 30.85,47.75 v30.85,46.22
D+  (via drill 0.2)
  Top 0.203: v39.87,28.31 R2.1 39.22,30.35 38.98,30.35 38.6,30.73 Z2.1
  Bottom 0.203: J1.P3 40.51,27.68 v39.87,28.31
D-  (via drill 0.2)
  Top 0.203: v40.76,28.31 40.76,28.68 R3.1 42.43,30.35 42.54,30.35 43.05,30.85 Z1.1
  Bottom 0.203: J1.P2 41.17,27.91 v40.76,28.31
GND  (via drill 0.2)
  Top 0.203: ATMEL32U4.15 45.32,49.03 45.59,48.76 45.59,48.51 46.6,47.49 48.38,47.49 48.76,47.87 48.76,48.13 | ATMEL32U4.43 36.6,48.03 36.32,47.75 36.32,47.11 | ATMEL32U4.5 40.01,45.45 40.38,45.08
  other vias: 49.27,30.85 50.54,30.85 44.95,37.2 45.71,37.2 51.3,45.08 55.75,45.46 49.02,50.67 29.71,51.68 30.47,52.57 31.49,28.31 32.63,27.17 52.7,35.55 33.52,36.19 35.17,36.19 28.57,33.52 29.46,35.55 35.05,44.32 42.79,55.75 44.57,56.89 30.98,55.37 45.71,31.87 38.73,36.82 42.03,37.08 37.84,44.44 35.43,52.83 29.46,49.52 36.19,47.24 41.65,34.03 38.73,34.03 36.57,40 36.44,43.81 33.27,51.05 35.3,50.67 29.58,42.16 24.63,48.25 21.84,33.01 44.7,53.59 45.97,53.21 48.13,57.78 29.46,37.71 30.73,36.19 43.3,53.59 33.14,44.82 33.9,34.03 33.65,31.87 36.95,32.25 21.71,47.11 26.66,44.44 26.54,46.48 51.43,38.73
  pour Top (isolate 0.127, no thermals): 59.56,30.35 59.56,50.67 50.67,59.56 30.35,59.56 21.46,50.67 21.46,29.08 29.08,21.46 50.67,21.46
  pour Bottom (isolate 0.127, no thermals): 59.56,30.35 59.56,50.67 50.67,59.56 30.35,59.56 21.46,50.67 21.46,29.08 29.08,21.46 50.67,21.46
MISO
  Top 0.203: J2.1 48.89,41.65 47.49,42.92 46.09,42.92 45.84,43.17 45.84,44.19 43.81,46.22 43.42,46.22 ATMEL32U4.11
MOSI
  Top 0.203: ATMEL32U4.10 42.51,46.13 42.79,45.84 43.55,45.84 45.33,44.06 45.33,43.05 45.84,42.54 47.36,42.54 47.87,42.03 47.87,41.01 46.86,40 J2.5
N$1
  Top 0.254: ATMEL32U4.17 46.09,50.03 46.66,50.6 16M.1
N$2
  Top 0.254: ATMEL32U4.16 45.83,49.53 46.22,49.14 46.22,48.63 46.66,48.2 16M.3
N$3
  Top 0.203: IC4.1 49.4,34.45 49.4,33.52 48.51,32.63 45.46,32.63 44.95,32.12 44.95,29.2 45.33,28.82 45.33,26.28 44.57,25.52 43.05,25.52 42.54,25.01 42.54,24.38 42.16,24 CHG.C
N$4
  Top 0.203: R20.1 36.06,26.28 36.82,25.52 38.22,25.52 38.6,25.14 38.6,24.38 38.98,24 CHG.A
N$5  (via drill 0.2)
  Top 0.203: ATMEL32U4.6 v40.51,45.71 | C1.2 36.33,44.57 v36.44,44.57
  Bottom 0.203: v40.51,45.71 38.22,45.71 37.08,44.57 v36.44,44.57
N$6
  Top 0.203: ATMEL32U4.42 36.59,48.53 35.17,47.11 35.17,46.48 35.55,46.09 36.44,46.09 36.44,45.46 35.93,44.95 C2.2
N$7
  Top 0.203: TXD.A 42.68,58.4 43.43,57.65 43.43,57.02 44.32,56.13 45.84,56.13 46.09,56.38 R8.1
N$8
  Top 0.203: MCU6050.10 40.78,37.1 39.87,36.19 C4.1
N$9  (via drill 0.2)
  Top 0.203: MCU6050.20 41.29,43.32 41.52,43.55 v43.43,43.55 | C3.1 46.71,45.08 v45.71,45.08
  Bottom 0.203: v43.43,43.55 44.95,45.08 v45.71,45.08
N$10
  Top 0.203: R7.1 32.87,58.67 36.43,58.67 D7.A
N$11
  Top 0.203: ATMEL32U4.33 37.6,53.84 35.3,53.84 34.92,54.22 34.92,54.86 34.66,55.11 R1.2 34.41,55.11
N$12
  Top 0.203: T5.3 30.73,31.26 30.73,30.09 31.12,29.7 R18.2
N$13
  Top 0.203: R21.1 56.24,46.22 PWR.A
N$14
  Top 0.203: R12.2 48.63,53.84 48.89,53.59 48.89,53.33 49.65,52.57 T2.3
N$15
  Top 0.203: T1.3 31.64,49.68 32,50.03 R10.2
N$16  (via drill 0.36)
  Top 0.813: T1.1 v27.81,49.78
  Bottom 0.813: v27.81,49.78 27.32,49.27 22.35,49.27 22.22,49.4 arc36 JP1.P$1
N$17  (via drill 0.36)
  Top 0.813: T2.1 v52.42,50.69
  Bottom 0.813: v52.42,50.69 53.97,49.14 58.54,49.14 58.67,49.27 arc-33 JP3.P$1
N$18
  Top 0.203: R14.2 34.51,29.7 T3.3
N$19  (via drill 0.36)
  Top 0.813: T3.1 v33.55,24.28
  Bottom 0.813: v33.55,24.28 31.74,22.47 arc33 JP5.P$1
N$20
  Top 0.203: R16.2 48.48,29.7 T4.3
N$21  (via drill 0.36)
  Top 0.813: T4.1 v47.52,24.1
  Bottom 0.813: v47.52,24.1 49.27,22.35 arc-34 JP7.P$1
N$22
  Top 0.305: R19.1 28.81,31 27.43,32.38 T5.1
N$23  (via drill 0.2)
  Top 0.203: C9.1 38.71,34.78 38.98,35.05 v38.98,36.06
  Bottom 0.203: HMC5883.8 41.9,39.73 42.16,39.73 42.16,38.09 42.41,37.84 42.41,37.59 42.79,37.2 42.79,36.82 41.78,35.81 39.24,35.81 v38.98,36.06
N$24  (via drill 0.2)
  Top 0.254: LED7.C 16.22,10.79 arc-30 31.74,22.47 | 31.74,22.47 31.74,26.79 29.71,28.82 R19.2 28.84,29.7 26.54,32 24,32 22.35,33.65 22.35,49.27 arc28 10.92,64.92 LED4.C | LED6.C 64.79,10.79 64.13,10.79 arc33 49.14,22.47 | 49.14,22.47 31.74,22.47 | LED5.C 70.1,64.92 70.1,64.26 arc32 58.67,49.27 v58.67,47.87 | v57.78,37.97 57.14,37.33 57.14,36.44 58.79,34.79 58.79,32.89 58.03,32.12 54.1,32.12 49.52,27.55 49.52,25.27 49.14,24.89 49.14,22.47
  Bottom 0.254: v58.67,47.87 58.29,47.49 58.29,38.47 v57.78,37.97
N$25
  Bottom 0.203: U3.6 49.93,33.21 C6.1
N$26
  Top 0.203: R22.2 44.95,34.48 IC4.5
N$27
  Bottom 0.203: U3.4 49.93,35.11 C6.2
N$28  (via drill 0.2)
  Top 0.203: C9.2 v37.97,37.2
  Bottom 0.203: HMC5883.12 39.76,38.11 39.24,37.59 38.35,37.59 v37.97,37.2
N$29  (via drill 0.2)
  Top 0.203: v41.27,36.82 41.78,36.32 C10.1
  Bottom 0.203: HMC5883.10 40.76,37.34 v41.27,36.82
N$30  (via drill 0.36)
  Top 0.813: SW2.COM 54.6,41.27 53.84,40.51 v53.84,38.47 v53.84,37.59
  Bottom 0.813: VCC.1 v53.84,38.47
N$31
  Bottom 0.203: C11.1 33.69,32.51 36.06,32.51 36.67,33.11 U4.4
N$32  (via drill 0.2)
  Top 0.203: R23.1 v32,56.38 | D8.A 38.59,58.41 37.97,58.41 37.2,57.65 v35.05,57.65
  Bottom 0.203: v32,56.38 32,57.14 32.51,57.65 v35.05,57.65
N$34  (via drill 0.2)
  Top 0.203: T7.3 51.85,48.14 50.92,48.14 | 50.92,48.14 R24.2 | 50.92,48.14 v50.92,47.62
  Bottom 0.203: 50.96,47.65 v50.92,47.62 50.92,47.21 U7.4
N$35  (via drill 0.2)
  Top 0.203: R26.2 48.27,52.44 v48.89,52.44
  Bottom 0.203: v48.89,52.44 48.74,52.3 BT4.0.4
RESET  (via drill 0.2)
  Top 0.203: ATMEL32U4.13 44.41,48.03 44.7,47.75 44.7,46.35 45.21,45.84 v45.71,45.84
  Top 0.305: R4.1 46.09,46.22 v45.71,45.84
  Bottom 0.203: J2.3 44.82,42.03 46.35,43.55 46.35,45.21 v45.71,45.84
RX  (via drill 0.2)
  Top 0.203: ATMEL32U4.20 44.67,51.53 v45.21,52.06
  Bottom 0.203: BT4.0.2 45.97,54.1 45.33,53.46 45.33,52.19 v45.21,52.06
RXLED  (via drill 0.2)
  Top 0.203: ATMEL32U4.8 41.51,45.98 42.41,45.08 43.05,45.08 43.94,44.19 v43.94,42.92
  Bottom 0.203: v43.94,42.92 44.32,42.92 RXD.1
SCK
  Top 0.203: ATMEL32U4.9 42.01,45.99 42.54,45.46 43.3,45.46 44.82,43.94 44.82,42.92 46.22,41.52 J2.2
SCL  (via drill 0.2)
  Top 0.203: 39.74,43.3 v39.87,43.43 | v42.92,44.06 41.4,44.06 40.76,43.43 v39.87,43.43 | MCU6050.23 39.74,43.3 | 39.74,43.3 arc-90 v39.87,43.43 | v36.32,42.54 34.92,41.14 R6.1 | ATMEL32U4.18 45.71,50.53 v46.09,50.92
  Bottom 0.203: HMC5883.1 39.76,43.31 v39.87,43.43 38.6,43.43 37.71,42.54 v36.32,42.54 34.66,42.54 | v42.92,44.06 43.05,44.06 45.59,46.6 45.59,46.86 46.73,48 46.73,50.16 46.09,50.79 v46.09,50.92 | 34.66,42.54 32.89,42.54 31.36,41.01 31.36,40 30.35,38.98 28.19,38.98 27.66,39.51 J4.4 | BMP180.5 34.61,42.48 34.66,42.54
SDA  (via drill 0.2)
  Top 0.203: v38.65,42.59 MCU6050.24 39.24,43.81 39.36,43.94 40.63,43.94 41.27,44.57 v42.41,44.57 | ATMEL32U4.19 45.19,51.03 v45.59,51.43 | v36.32,41.27 34.92,39.87 R5.1 34.17,39.63 33.52,38.98 32.63,38.98 v32,38.35
  Bottom 0.203: BMP180.6 36.01,41.96 36.32,41.65 v36.32,41.27 38.35,41.27 | 38.35,41.27 39.12,41.27 HMC5883.16 | 38.35,41.27 38.4,41.32 38.4,42.33 v38.65,42.59 | v42.41,44.57 42.79,44.57 45.08,46.86 45.08,46.98 46.09,48 46.09,49.9 45.46,50.54 45.46,51.3 v45.59,51.43 | v32,38.35 26.35,38.35 J4.5
TX
  Top 0.203: ATMEL32U4.21 44.54,52.03 44.7,52.19 44.7,52.44 44.95,52.7 45.59,52.7 45.71,52.57 R26.1
TXLED
  Top 0.203: ATMEL32U4.22 43.94,52.56 43.94,55.75 42.78,56.9 TXD.C
USBD+  (via drill 0.2)
  Top 0.305: ATMEL32U4.4 39.51,45.19 v39.62,45.08 | v43.81,37.97 43.43,37.59 43.43,37.2 43.55,37.08 43.55,33.9 42.54,32.89 41.14,32.89 39.87,31.62 R2.2
  Bottom 0.305: v39.62,45.08 40.89,45.08 43.55,42.41 43.55,38.22 v43.81,37.97
USBD-  (via drill 0.2)
  Top 0.305: ATMEL32U4.3 39.01,45.23 v38.86,45.08 | v44.06,37.33 44.06,33.14 43.3,32.38 42.28,32.38 41.78,31.87 R3.2
  Bottom 0.305: v44.06,37.33 43.55,37.33 42.92,37.97 42.92,42.16 40.63,44.44 38.86,44.44 v38.86,45.08
VCC
  Top 0.406: IC4.3 53.9,36.38 55.49,37.97 SW2.A
VUSB  (via drill 0.2, 0.36)
  Top 0.203: ATMEL32U4.7 41.01,45.98 41.14,45.84 41.14,45.59 v41.52,45.21
  Top 0.305: ATMEL32U4.2 38.51,45.87 37.84,45.21 v36.95,45.21 37.08,45.08 37.08,44.06 37.46,43.68 37.46,38.6 37.2,38.35
  Top 0.406: 37.2,38.35 36.19,37.33 | 36.19,37.33 C17.2 | 36.19,37.33 36.06,37.2 R20.2 36.81,31 37.46,30.35 v37.46,28.95 | v44.32,28.44 44.32,32.38 45.21,33.27 47.49,33.27 48.13,33.9 48.13,35.43 47.18,36.38 IC4.4 46.83,36.92 48,38.09 51.68,38.09 52.95,39.36 52.95,41.65 52.44,42.16 52.44,44.7 54.22,46.48 T7.1
  Bottom 0.203: J1.P1 41.83,27.35 | v41.52,45.21 41.52,45.97 41.27,46.22 37.97,46.22 v36.95,45.21
  Bottom 0.406: 41.83,27.35 41.83,28.44 | v44.32,28.44 41.83,28.44 | 41.83,28.44 41.19,29.08 37.59,29.08 v37.46,28.95

### Text on the board
tPlace: duinopeak.com/crazebird | duinopeak.com/crazebird | Crazebird | R | S | I | SCL | SDA | G | MO | V | CH/NO | 3.3V | GND | duinopeak.com/crazebird | duinopeak.com/crazebird
bPlace: + | + | duinopeak.com/crazebird | duinopeak.com/crazebird | A1/A5 | D11 | D12 | D13 | BMP180 | SCL | SDA | CH/NO | 3.3V | GND | 15.5.25v0.5 | VCC | GND | duinopeak.com/crazebird | + | + | duinopeak.com/crazebird
tNames: 2015/3/9-v1.0